# Altium schematic sheet Shield_delitel.SchDoc
size A4
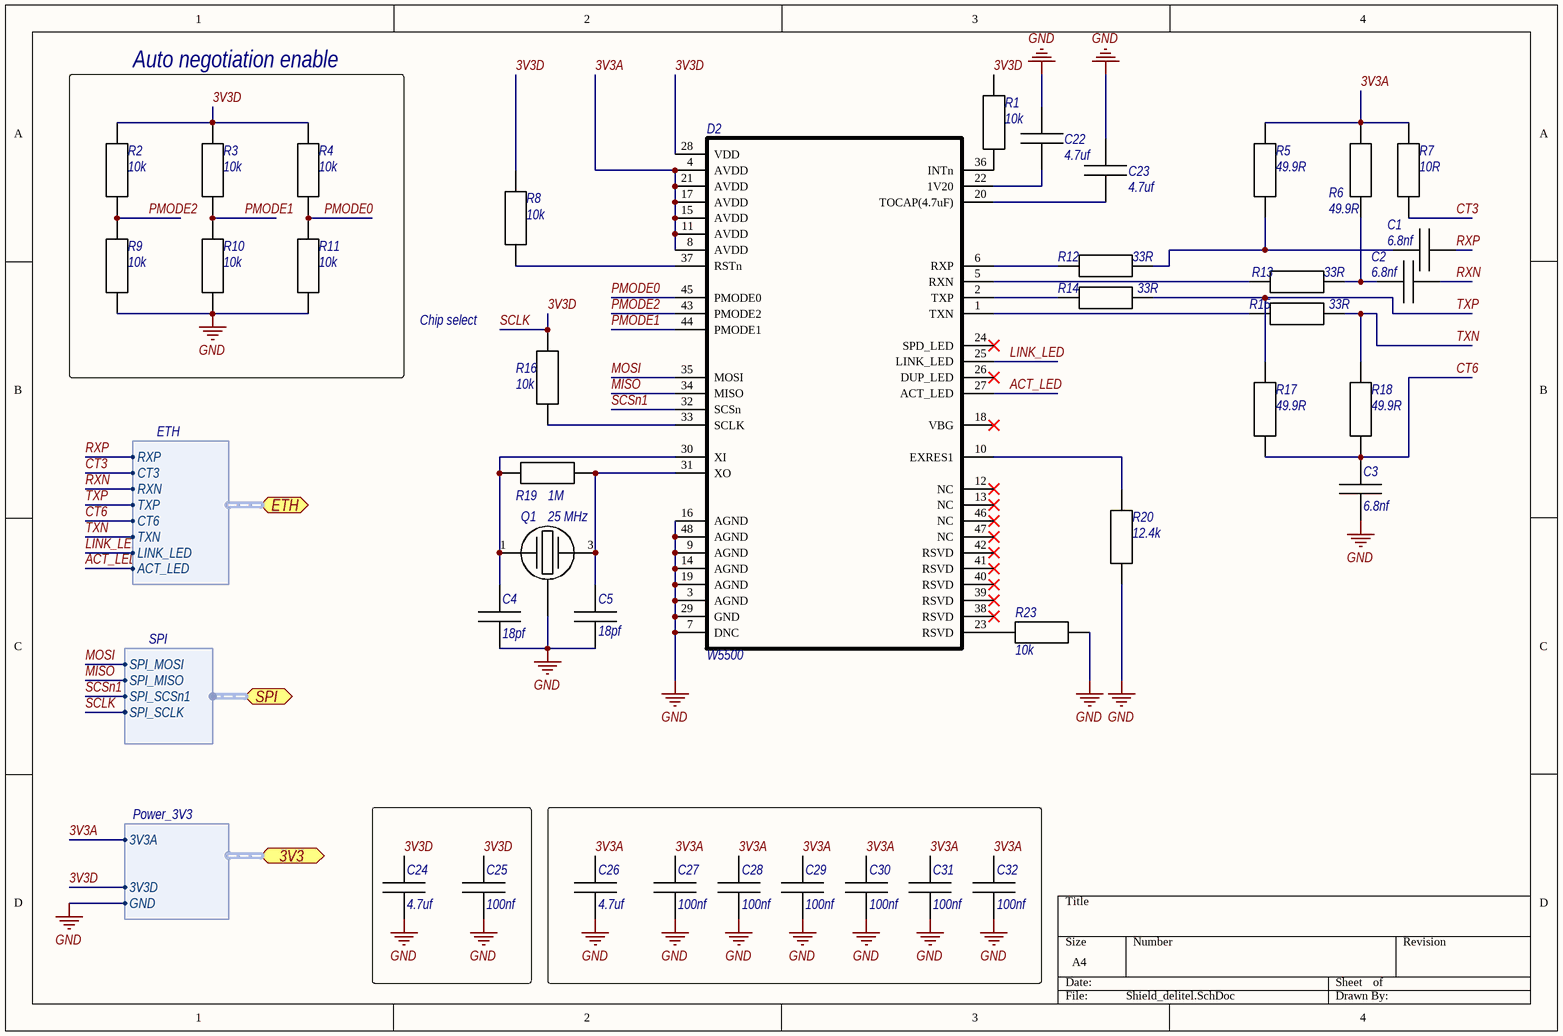
[diagram p0: Shield_delitel.SchDoc]

## Parts
C1  6.8nf
C2  6.8nf
C3  6.8nf
C4  18pf
C5  18pf
C22  4.7uf
C23  4.7uf
C24  4.7uf
C25  100nf
C26  4.7uf
C27  100nf
C28  100nf
C29  100nf
C30  100nf
C31  100nf
C32  100nf
D2  W5500  [LQFP-48 7.0 x 7.0 x 1.6]
Q1  25 MHz
R1  10k
R2  10k
R3  10k
R4  10k
R5  49.9R
R6  49.9R
R7  10R
R8  10k
R9  10k
R10  10k
R11  10k
R12  33R
R13  33R
R14  33R
R15  33R
R16  10k
R17  49.9R
R18  49.9R
R19  1M
R20  12.4k
R23  10k

## Blocks framed on the sheet
Auto negotiation enable: R2-R4 R9-R11

## Ports
3V3 (harness Power_3V3), ETH (harness ETH), SPI (harness SPI)

## Harnesses
ETH: RXP, RXN, TXP, TXN, CT3, CT6, ACT_LED, LINK_LED
SPI: SPI_MOSI, SPI_MISO, SPI_SCSn1, SPI_SCLK
Power_3V3: 3V3A, GND, 3V3D

## Nets
GND: C3.1 C4.1 C5.1 C22.1 C23.1 C24.1 C25.1 C26.1 C27.1 C28.1 C29.1 C30.1 C31.1 C32.1 D2.3(AGND) D2.7(DNC) D2.9(AGND) D2.14(AGND) D2.16(AGND) D2.19(AGND) D2.29(GND) D2.48(AGND) Q1.2 Q1.4 R9.1 R10.1 R11.1 R20.1 R23.1 ; port 3V3.GND
3V3A: C26.2 C27.2 C28.2 C29.2 C30.2 C31.2 C32.2 D2.4(AVDD) D2.8(AVDD) D2.11(AVDD) D2.15(AVDD) D2.17(AVDD) D2.21(AVDD) R5.1 R6.1 R7.1 ; port 3V3.3V3A
3V3D: C24.2 C25.2 D2.28(VDD) R1.2 R2.2 R3.2 R4.2 R8.2 R16.1 ; port SPI.SPI_SCLK, port 3V3.3V3D  [also labelled SCLK]
ACT_LED: D2.27(ACT_LED) ; port ETH.ACT_LED
CT3: R7.2 ; port ETH.CT3
CT6: C3.2 R17.2 R18.2 ; port ETH.CT6
LINK_LED: D2.25(LINK_LED) ; port ETH.LINK_LED
MISO: D2.34(MISO) ; port SPI.SPI_MISO
MOSI: D2.35(MOSI) ; port SPI.SPI_MOSI
PMODE0: D2.45(PMODE0) R4.1 R11.2
PMODE1: D2.44(PMODE1) R3.1 R10.2
PMODE2: D2.43(PMODE2) R2.1 R9.2
RXN: C2.1 ; port ETH.RXN
RXP: C1.1 ; port ETH.RXP
SCSn1: D2.32(SCSn) ; port SPI.SPI_SCSn1
TXN: R15.1 R18.1 ; port ETH.TXN
TXP: R14.1 R17.1 ; port ETH.TXP
NetC1_2: C1.2 R5.2 R12.1
NetC2_2: C2.2 R6.2 R13.1
NetC4_2: C4.2 D2.30(XI) Q1.1 R19.2
NetC5_2: C5.2 D2.31(XO) Q1.3 R19.1
NetC22_2: C22.2 D2.22(1V20)
NetC23_2: C23.2 D2.20(TOCAP(4.7uF))
NetD2_1: D2.1(TXN) R15.2
NetD2_2: D2.2(TXP) R14.2
NetD2_5: D2.5(RXN) R13.2
NetD2_6: D2.6(RXP) R12.2
NetD2_10: D2.10(EXRES1) R20.2
NetD2_23: D2.23(RSVD) R23.2
NetD2_33: D2.33(SCLK) R16.2
NetD2_36: D2.36(INTn) R1.1
NetD2_37: D2.37(RSTn) R8.1

Not connected (* = marked no-connect by the designer): D2 12(NC)* 13(NC)* 18(VBG)* 24(SPD_LED)* 26(DUP_LED)* 38(RSVD)* 39(RSVD)* 40(RSVD)* 41(RSVD)* 42(RSVD)* 46(NC)* 47(NC)*

## Notes on the sheet
- Chip select

## Library data of the parts
C1-C5 C22-C32 = Capacitor
Q1 = Oscillator
R1-R20 R23 = Resistor